# EAGLE design power_eX3 (EAGLE 9.1.3)
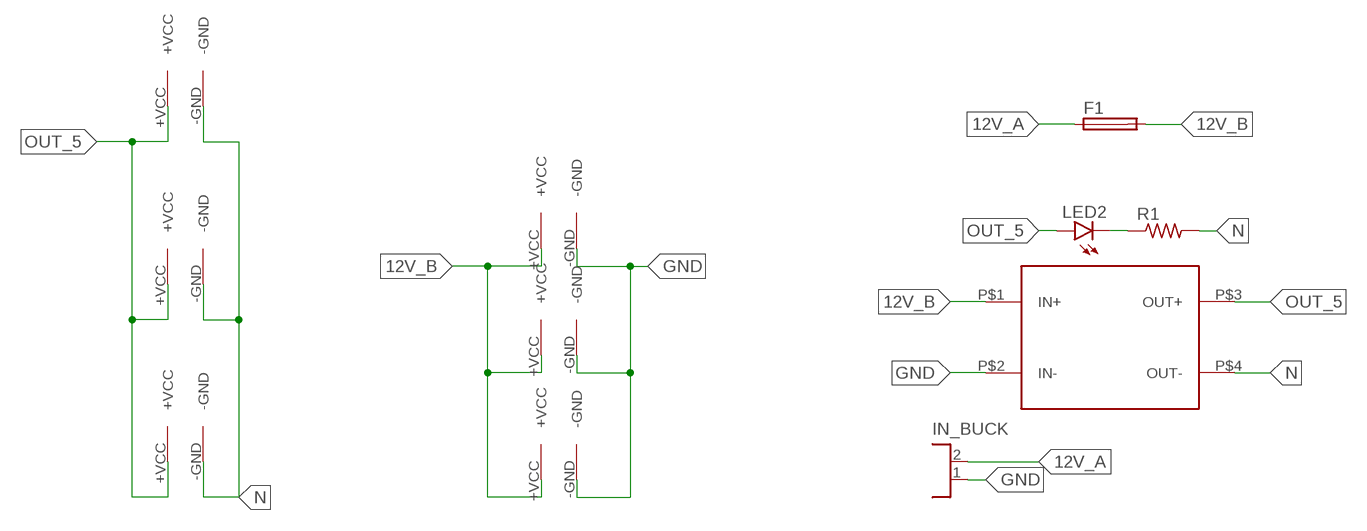
[diagram p0: schematic, sheet 1]

## Parts
F1  GSH15  [GSH15]
IN_BUCK  2P  [DG55CB-2P-1]
LED2  LED3MM  [LED3MM]
MM1  XT60  [XT60]
MM2  XT60  [XT60]
MM3  XT60  [XT60]
MM4  XT60  [XT60]
MM5  XT60  [XT60]
MM6  XT60  [XT60]
R1  R-US_0207/7  [0207/7]
U$2  LM2595_BUCK_5A_LEDDIP8  [LM2595_BUCK_5A_LED]

## Nets
12V_A: F1.1 IN_BUCK.2
12V_B: F1.2 MM4.+VCC MM5.+VCC MM6.+VCC U$2.P$1(IN+)
GND: IN_BUCK.1 MM4.-GND MM5.-GND MM6.-GND U$2.P$2(IN-)
N: MM1.-GND MM2.-GND MM3.-GND R1.2 U$2.P$4(OUT-)
N$3: LED2.K(C) R1.1
OUT_5: LED2.A MM1.+VCC MM2.+VCC MM3.+VCC U$2.P$3(OUT+)

## Library data of the parts
F1 = fuse:GSH15: FUSE HOLDER grid 15mm, 19649 Wickmann; MPN: 64900001039; OC_FARNELL: 1271673; OC_NEWARK: 02P0318
IN_BUCK = con-dg55:2P: DEGSON DG55 CONNECTOR
LED2 = led:LED: LED OSRAM: - CHIPLED LG R971, LG N971, LY N971, LG Q971, LY Q971, LO R971, LY R971 LH N974, LH R974 LS Q976, LO Q976, LY Q976 LO Q996 - Hyper CHIPLED LW Q18S LB Q993, LB Q99A, LB R99A - SideLED LS A670, LO A670, LY A670, LG A670, LP A670 LB A673, LV A673, LT A673, LW A673 LH A674 LY A675 LS A676, LA A676, LO A676, LY A676, LW A676 LS A679, LY A679, LG A679 - Hyper Micro SIDELED® LS Y876, LA Y876, LO Y876, LY Y876 LT Y87S - SmartLED LW L88C, LW L88S LB L89C, LB L89S, LG L890 LS L89K, LO L89K, LY L89K LS L896, LA L896, LO L896, LY L896 - TOPLED LS T670, LO T670, LY T670, LG T670, LP T670 LSG T670, LSP T670, LSY T670, LOP T670, LYG T670 LG T671, LOG T671, LSG T671 LB T673, LV T673, LT T673, LW T673 LH T674 LS T676, LA T676, LO T676, LY T676, LB T676, LH T676, LSB T676, LW T676 LB T67C, LV T67C, LT T67C, LS T67K, LO T67K, LY T67K, LW E67C LS E67B, LA E67B, LO E67B, LY E67B, LB E67C, LV E67C, LT E67C LW T67C LS T679, LY T679, LG T679 LS T770, LO T770, LY T770, LG T770, LP T770 LB T773, LV T773, LT T773, LW T773 LH T774 LS E675, LA E675, LY E675, LS T675 LS T776, LA T776, LO T776, LY T776, LB T776 LHGB T686 LT T68C, LB T68C - Hyper Mini TOPLED® LB M676 - Mini TOPLED Santana® LG M470 LS M47K, LO M47K, LY M47K Source: http://www.osram.convergy.de LUXEON: - LUMILED® LXK2-PW12-R00, LXK2-PW12-S00, LXK2-PW14-U00, LXK2-PW14-V00 LXK2-PM12-R00, LXK2-PM12-S00, LXK2-PM14-U00 LXK2-PE12-Q00, LXK2-PE12-R00, LXK2-PE12-S00, LXK2-PE14-T00, LXK2-PE14-U00 LXK2-PB12-K00, LXK2-PB12-L00, LXK2-PB12-M00, LXK2-PB14-N00, LXK2-PB14-P00, LXK2-PB14-Q00 LXK2-PR12-L00, LXK2-PR12-M00, LXK2-PR14-Q00, LXK2-PR14-R00 LXK2-PD12-Q00, LXK2-PD12-R00, LXK2-PD12-S00 LXK2-PH12-R00, LXK2-PH12-S00 LXK2-PL12-P00, LXK2-PL12-Q00, LXK2-PL12-R00 Source: www.luxeon.com KINGBRIGHT: KA-3528ASYC Source: www.kingbright.com
MM1-MM6 = torpedo:XT60
R1 = rcl:R-US_: RESISTOR, American symbol; SPICEPREFIX: R
U$2 = LM2595_5A_LED:LM2595_BUCK_5A_LED: LM2595_BUCK_5A_LED

## Board
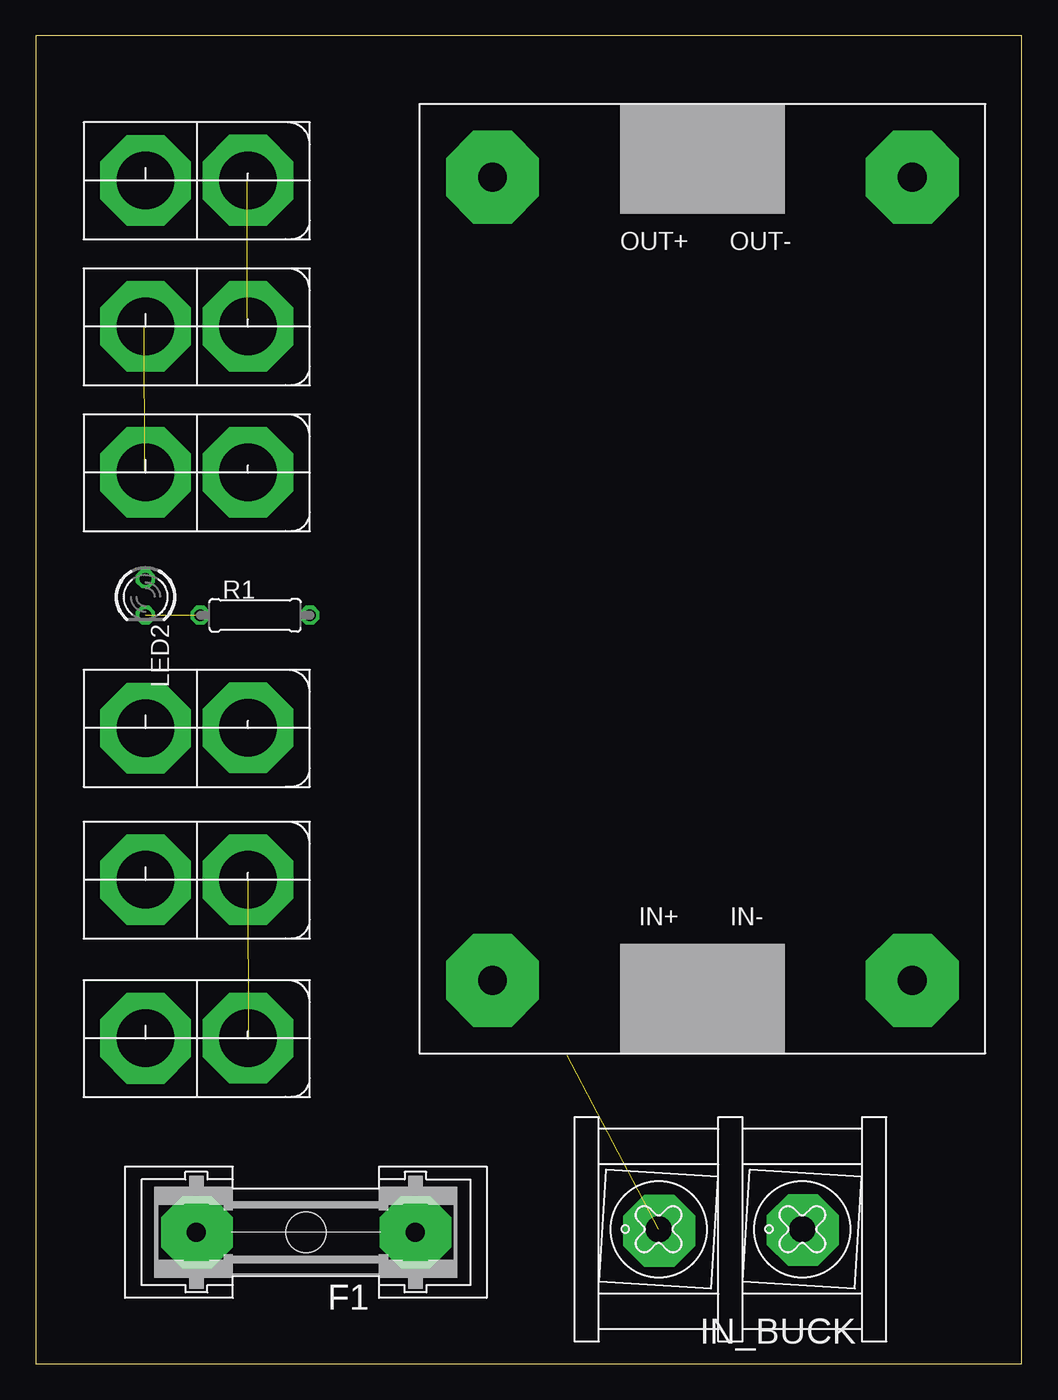
[diagram p1: board, top side]
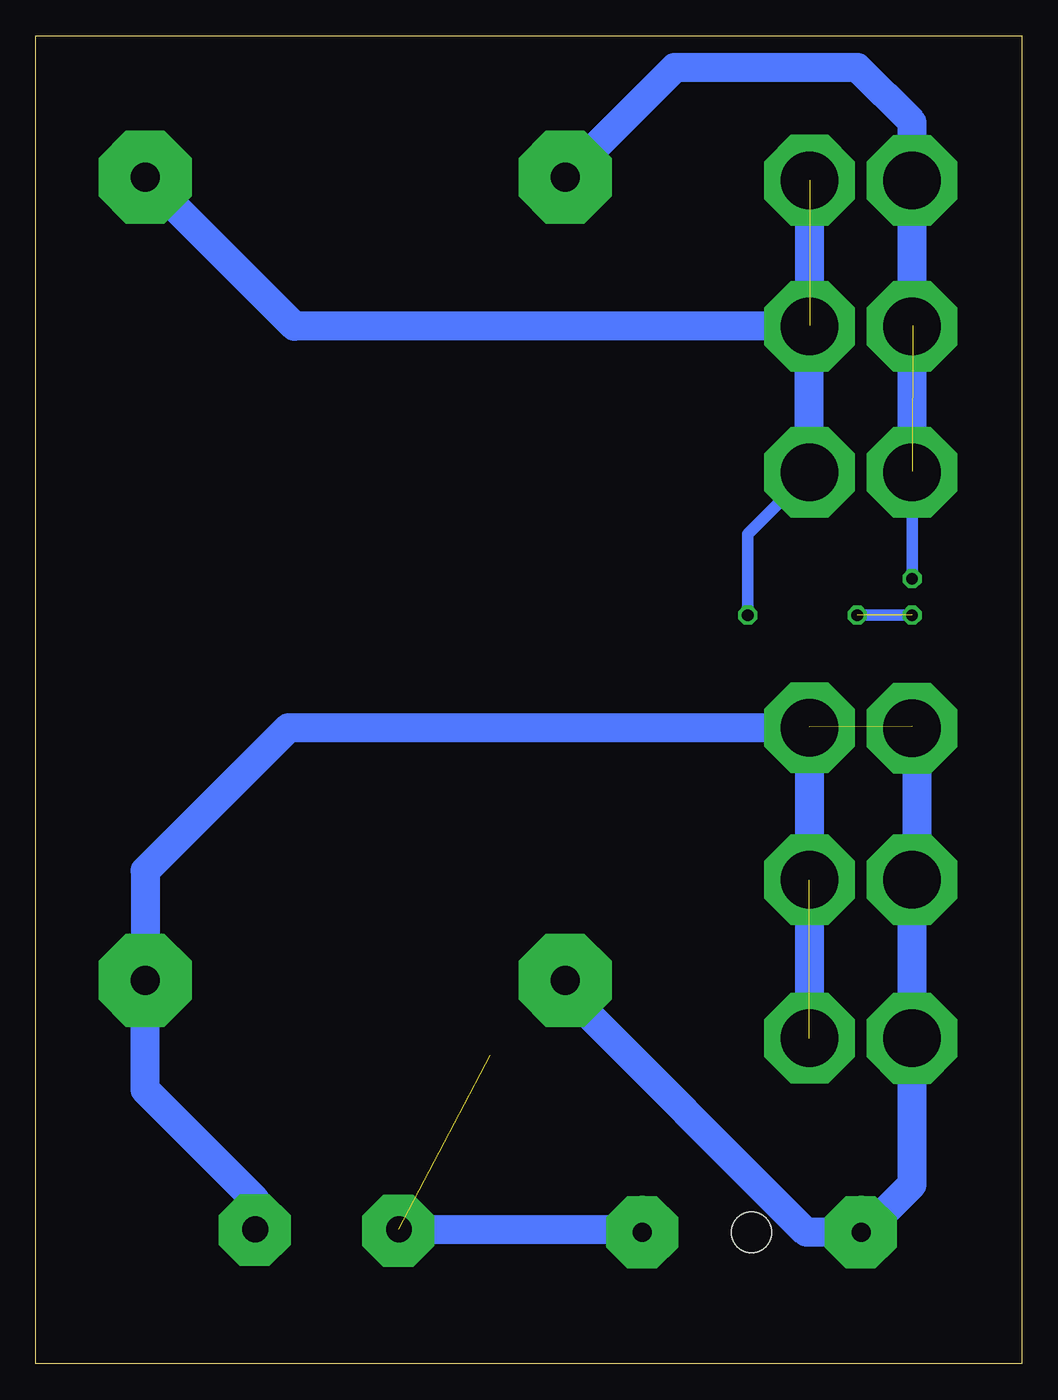
[diagram p2: board, bottom side, seen from below]

Size 68.56 x 92.38 mm. Coordinates in mm from the lower left corner, seen from the top.
Outline: 0,0 68.56,0 68.56,92.38 0,92.38 0,0
Copper layers (1*16): Top 0.035mm / dielectric 1.5mm / Bottom 0.035mm
Design rules "default *": minimum track width 0.8mm, minimum drill 0.8mm, track to track 0.8mm, track to pad 0.8mm, pad to pad 8mil, via to via 8mil, smd to smd 8mil, copper to edge 40mil, drill to drill 8mil, minimum pad ring 10mil, minimum via ring 8mil, stop-mask expansion 4mil, vias tented up to drill 0mil, thermal gap 10mil

### Footprints (pad centres in the part's own frame; a part is rotated, then mirrored left to right if it is on the bottom)
GSH15 = drill 1.321 pad 2.54 long: 1 -7.62,0; 2 7.62,0 | hole 2.794: 0,0
DG55CB-2P-1 = drill 1.8 pad 3.6: 1 -5,0; 2 5,0
LED3MM = drill 0.813 octagon: A -1.27,0; K 1.27,0
XT60 = drill 4 pad 6.3 octagon: +VCC 11.43,4.04; -GND 4.29,4.02
0207/7 = drill 0.813 octagon: 1 -3.81,0; 2 3.81,0
LM2595_BUCK_5A_LED = drill 2 pad 6.452 octagon: P$1 5.08,5.08; P$2 34.29,5.08; P$3 5.08,60.96; P$4 34.29,60.96

### Placement (x,y rotation side)
F1  18.78,9.13 180 top
IN_BUCK  48.31,9.35 180 top
LED2  7.62,53.34 270 top
MM1  19.05,66.04 180 top
MM2  19.05,76.2 180 top
MM3  19.05,86.36 180 top
MM4  19.05,26.67 180 top
MM5  19.05,37.7 180 top
MM6  19.05,48.26 180 top
R1  15.24,52.07 0 top
U$2  26.67,21.59 0 top

### Tracks (layer width: path | path; a pad name or v marks a point on that pad's centre or on a via)
12V_A  (1 unrouted)
  Bottom 2: IN_BUCK.2 26.61,9.35 F1.1
12V_B
  Bottom 2: MM6.+VCC 7.25,44.59 7.25,34.02 MM5.+VCC MM4.+VCC 7.62,12.47 10.96,9.13 F1.2 14.97,9.13 31.75,25.91 U$2.P$1
GND
  Bottom 2: MM6.-GND MM5.-GND MM4.-GND | MM6.-GND 14.76,45.24 | MM6.-GND 51.01,44.24 60.96,34.29 U$2.P$2 60.96,19.05 53.31,11.4 IN_BUCK.1
N
  Bottom 0.8: 14.88,82.47 MM3.-GND | MM1.-GND 19.05,57.73 R1.2
  Bottom 2: MM1.-GND MM2.-GND | MM3.-GND MM2.-GND | MM2.-GND 50.59,72.18 U$2.P$4
N$1  (via drill 0.8 pad 5)
  other vias: 53.35,9.29
N$2  (via drill 0.8 pad 5)  (1 unrouted)
  other vias: 14.77,44.31 7.59,44.34
N$3  (1 unrouted)
  Bottom 0.813: LED2.K R1.1
N$4  (via drill 0.8 pad 5)  (1 unrouted)
  other vias: 14.71,72.22 14.71,82.34
N$6  (via drill 0.8 pad 5)
  other vias: 7.57,33.79
N$7  (via drill 0.8 pad 5)
  other vias: 14.71,61.96
N$8  (via drill 0.8 pad 5)  (1 unrouted)
  other vias: 7.58,62.11 7.55,72.22
N$9  (via drill 0.8 pad 5)
  other vias: 7.62,82.55
N$10  (via drill 0.8 pad 5)
  other vias: 7.63,22.61
N$11  (via drill 0.8 pad 5)  (1 unrouted)
  other vias: 14.79,22.61 14.77,33.66
N$12  (via drill 0.8 pad 5)
  other vias: 26.4,9.13
N$13  (via drill 0.8 pad 5)
  other vias: 11.2,9.13
N$16  (via drill 0.8 pad 5)
  other vias: 43.35,9.24
OUT_5
  Bottom 0.8: 8.13,82.58 MM3.+VCC | MM3.+VCC 7.33,81.78 7.33,72.18 MM2.+VCC 7.33,71.38 7.33,62.58 MM1.+VCC LED2.A | 7.63,82.72 MM3.+VCC
  Bottom 0.813: LED2.A 7.46,54.61
  Bottom 2: MM1.+VCC 7.62,82.71 7.63,82.72 | MM3.+VCC 7.62,86.36 11.43,90.17 24.13,90.17 U$2.P$3